# EAGLE schematic SMD_Breakout_LargeHeader (EAGLE 7.2.0)
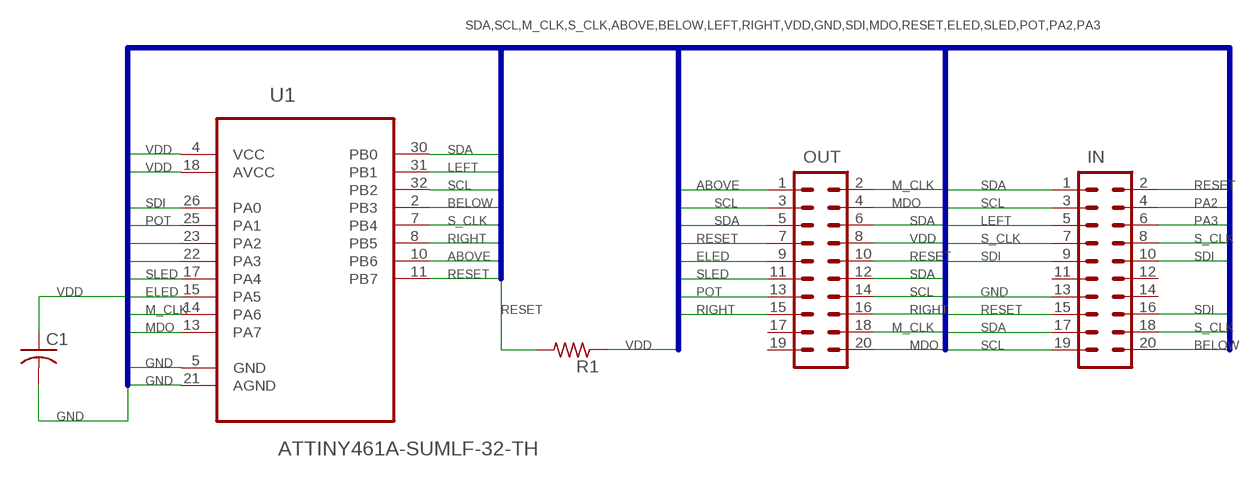
[diagram p0: schematic, sheet 1]

## Parts
C1  C-USC0603  [C0603]
IN  M10X2  [2X10]
OUT  M10X2  [2X10]
R1  R-US_R0603  [R0603]
U1  ATTINY461A-SUMLF-32-TH  [MLF32-TH]

## Nets
ABOVE: OUT.1 U1.10(PB6)
BELOW: IN.20 U1.2(PB3)
ELED: OUT.9 U1.15(PA5)
GND: C1.2 IN.13 U1.5(GND) U1.21(AGND)
LEFT: IN.5 U1.31(PB1)
M_CLK: OUT.2 OUT.18 U1.14(PA6)
MDO: OUT.4 OUT.20 U1.13(PA7)
PA2: IN.4 U1.23(PA2)
PA3: IN.6 U1.22(PA3)
POT: OUT.13 U1.25(PA1)
RESET: IN.2 IN.15 OUT.7 OUT.10 R1.2 U1.11(PB7)
RIGHT: OUT.15 OUT.16 U1.8(PB5)
S_CLK: IN.7 IN.8 IN.18 U1.7(PB4)
SCL: IN.3 IN.19 OUT.3 OUT.14 U1.32(PB2)
SDA: IN.1 IN.17 OUT.5 OUT.6 OUT.12 U1.30(PB0)
SDI: IN.9 IN.10 IN.16 U1.26(PA0)
SLED: OUT.11 U1.17(PA4)
VDD: C1.1 OUT.8 R1.1 U1.4(VCC) U1.18(AVCC)
Unconnected: IN.11 IN.12 IN.14 OUT.17 OUT.19

## Buses
SDA,SCL,M_CLK,S_CLK,ABOVE,BELOW,LEFT,RIGHT,VDD,GND,SDI,MDO,RESET,ELED,SLED,POT,PA2,PA3

## Library data of the parts
C1 = rcl:C-US: CAPACITOR, American symbol
IN OUT = SparkFun-Connectors:M10X2: This was SPECIALLY designed to be used with our Graphic LCD Backpack. Be sure you want to use this! It is not only staggered on each line of header holes, but IT IS ALSO offset of the center point of the top and bottom lines by 5 mil. This causes the headers to lock into place on the "standard" footprint on the LCD screen. The extra squares on the tdocu layer are there simply to reference other pins (if you were to actually populate a longer header than ten long - this is what we do with the backpacks).
R1 = rcl:R-US_: RESISTOR, American symbol
U1 = Atmel_By_element14_Batch_1-00:ATTINY461A-SU: 8-bit Microcontroller with In-System Programmable Flash